# Altium schematic sheet RoughGNSS.SchDoc
size A4; SheetNumber: 12; SheetTotal: 14
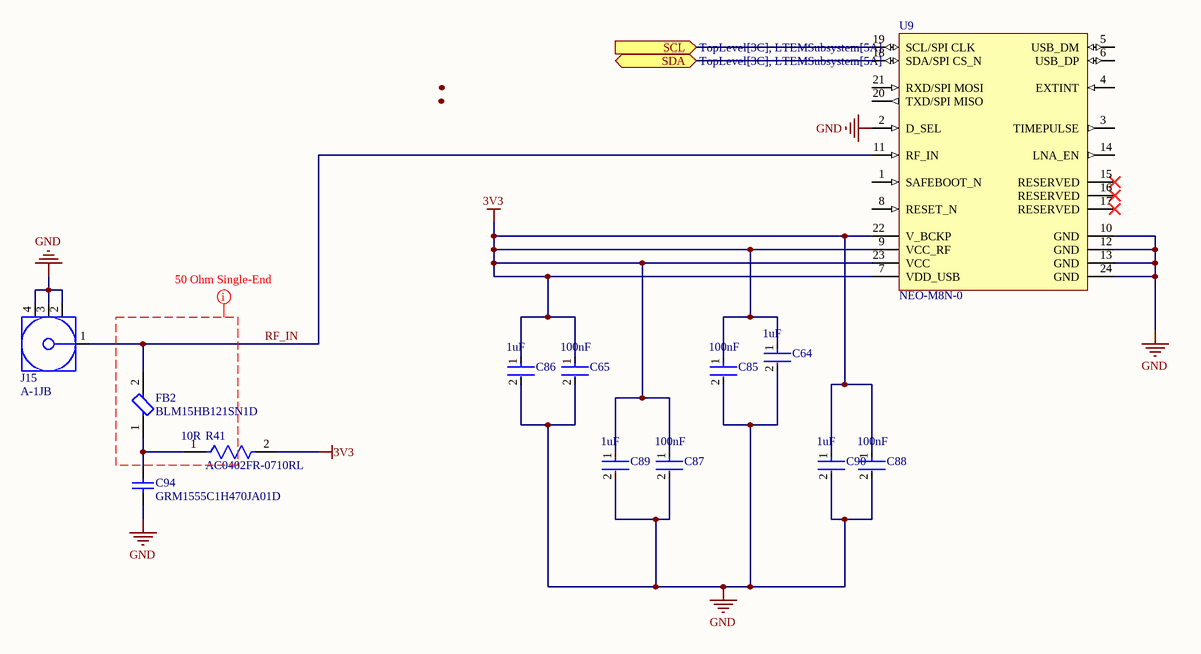
[diagram p0: RoughGNSS.SchDoc]

## Parts
C64  Capacitance: 1uF  [FP-CL511-IPC_C]  (hidden comment: CL05A105KP5NNNC)
C65  Capacitance: 100nF  [FP-GRM155-0_05-IPC_C]  (hidden comment: GRM155R71E104KE14J)
C85  Capacitance: 100nF  [FP-GRM155-0_05-IPC_C]  (hidden comment: GRM155R71E104KE14J)
C86  Capacitance: 1uF  [FP-CL511-IPC_C]  (hidden comment: CL05A105KP5NNNC)
C87  Capacitance: 100nF  [FP-GRM155-0_05-IPC_C]  (hidden comment: GRM155R71E104KE14J)
C88  Capacitance: 100nF  [FP-GRM155-0_05-IPC_C]  (hidden comment: GRM155R71E104KE14J)
C89  Capacitance: 1uF  [FP-CL511-IPC_C]  (hidden comment: CL05A105KP5NNNC)
C90  Capacitance: 1uF  [FP-CL511-IPC_C]  (hidden comment: CL05A105KP5NNNC)
C94  GRM1555C1H470JA01D  [CAPC1005X55X25LL05T10]
FB2  BLM15HB121SN1D  [FP-BLM15-0_05-IPC_B]
J15  A-1JB  [AMPH-A-1JB_V]
R41  AC0402FR-0710RL  Resistance: 10R  [FP-AC0402-IPC_B]
U9  NEO-M8N-0  [UBX-NEO-M8-24_V]

## Ports
SCL (in, see TopLevel[3C], LTEMSubsystem[5A]), SDA (bidir, see TopLevel[3C], LTEMSubsystem[5A])

## Nets
3V3: C64.1 C65.1 C85.1 C86.1 C87.1 C88.1 C89.1 C90.1 R41.2 U9.7(VDD_USB) U9.9(VCC_RF) U9.22(V_BCKP) U9.23(VCC)
GND: C64.2 C65.2 C85.2 C86.2 C87.2 C88.2 C89.2 C90.2 C94.1 J15.2 J15.3 J15.4 U9.2(D_SEL) U9.10(GND) U9.12(GND) U9.13(GND) U9.24(GND)
RF_IN: FB2.2 J15.1 U9.11(RF_IN)
SCL: U9.19(SCL/SPI_CLK) ; port SCL
SDA: U9.18(SDA/SPI_CS_N) ; port SDA
NetC94_2: C94.2 FB2.1 R41.1

Not connected (* = marked no-connect by the designer): U9 1(SAFEBOOT_N) 3(TIMEPULSE) 4(EXTINT) 5(USB_DM) 6(USB_DP) 8(RESET_N) 14(LNA_EN) 15(RESERVED)* 16(RESERVED)* 17(RESERVED)* 20(TXD/SPI_MISO) 21(RXD/SPI_MOSI)

## Layout directives
net class 50SE: (no net found under the mark)

## Library data of the parts
C64 C86 C89 C90 = CMP-13271-001936-1: Cap Ceramic 1uF 10V X5R ±10% SMD 0402 +85°C Paper T/R; Depth: 0.5mm; Case Code (Imperial): 0402; Material: Ceramic; Mount: Surface Mount; Thickness: 0.022inch; Dielectric: X5R; Radiation Hardening: No; Case/Package: 0402; Length: 1mm; Tolerance: 10%; Max Operating Temperature: 85°C; Package Quantity: 1; Width: 0.02inch; Voltage Rating: 10V; Contact Plating: Tin; Height: 0.5mm; Min Operating Temperature: -55°C; Case Code (Metric): 1005; Packaging: Tape and Reel
C65 C85 C87 C88 = CMP-06035-003995-1: Chip Multilayer Ceramic Capacitors for General Purpose, 0402, 0.10uF, X7R, 15%, 10%, 25V; Resistor Type: Ceramic; Tolerance: 10%; Case Code (Metric): 1005; Termination: SMD/SMT; Mount: Surface Mount; Voltage Rating: 25V; Voltage Rating (DC): 25V; Case Code (Imperial): 0402; Max Operating Temperature: 125°C; Weight: 0.000212oz; Case/Package: 0402; Length: 0.039inch; Width: 0.5mm; Thickness: 0.022inch; Height: 0.5mm; Packaging: Tape and Reel; Package Quantity: 50000; Min Operating Temperature: -55°C; Dielectric: X7R
C94 = CMP-2008-04368-1: Manufacturer: Murata; Part Number: GRM1555C1H470JA01D
FB2 = CMP-0686-00154-4: Chip Ferrite Bead, 0402, 120Ω @ 100MHz, 0.7Ω, 25%, 300mA; Impedance: 120R; DC Resistance (DCR): 700mR; Number of Lines: 1; Material: Steel; Lead Free: Lead Free; Min Operating Temperature: -55°C; Package Quantity: 10000; Tolerance: 25%; REACH SVHC: No SVHC; Termination: SMD/SMT; Number of Pins: 2; Frequency: 100MHz; Weight: 2.3E-05oz; Test Frequency: 100MHz; Series: BLM15H; Max DC Current: 300mA; Packaging: Tape and Reel; Width: 0.5mm; Max Current Rating: 300mA; Height: 0.5mm; Depth: 0.55mm; Case Code (Imperial): 0402; RoHS Compliant: Yes; Max Operating Temperature: 125°C; Current Rating: 300mA; Case Code (Metric): 1005; Number of Circuits: 1; Length: 1mm; Case/Package: 0402
J15 = CMP-1743-00001-1: AMC PCB Jack, 0 to 60 GHz, 60 V, -40 to 90 degC, 4-Pin SMD, RoHS, Tape and Reel; Capacitance: 100 uF; Case\Package: 2917; Voltage Rating (DC): 10 V; ESR: 700 mohm; Tolerance: 10%; ComponentLink1Description: Datasheet; PackageDescription: 4-Pin Surface Mount Device, Body 2.6 x 2.6 mm; Radiation Hardening: No; Package Quantity: 1; REACH SVHC: No SVHC; DatasheetVersion: Rev. K, 05/2016; ComponentLink1URL: http://drawings.amphenolrf.com/Customer_Outline/CA-1JB.pdf; Pins: 2; Packaging: Tape and Reel; Min Operating Temperature: -55 degC; RoHSCompliant: true; Length: 7.3 mm; PackageReference: A-1JB; Weight: 0.023634 oz; Mount: Surface Mount; Voltage Rating: 10 V; Max Operating Temperature: 125 degC; Height: 3.1 mm; Case Code (Imperial): 2917; Case Code (Metric): 7343; Width: 4.3 mm
R41 = CMP-2002-01791-3: RES 10Ω ±1% 0.063W 0402; Temperature Coefficient: 200ppm/°C; Power Rating: 62.5mW; Voltage Rating: 50V; Max Power Dissipation: 63mW; Min Operating Temperature: -55°C; Packaging: Tape and Reel; Number of Terminations: 2; Max Operating Temperature: 155°C; Size Code: 0402; Ratings: AEC-Q200; Tolerance: 1%; Resistor Type: Thick Film; Length: 1mm; Width: 0.5mm; Height: 0.32mm; Termination: SMD/SMT; Case/Package: 0402; Case Code (Metric): 1005; Lead Free: Lead Free; Features: Moisture Resistant; Series: AC; Case Code (Imperial): 0402
U9 = CMP-2000-07559-1: U-Blox M8 Concurrent Gnss Module, 3.6 V, -40 to 85 degC, 24-Pin SMD, RoHS, Tape and Reel; Mounting Technology: SurfaceMount; Manufacturer: U-Blox; Manufacturer URL: https://www.u-blox.com/en; Package Reference: NEO-M8N-0; Datasheet Version: Rev. R03, 08/2016; RoHSCompliant: False; Package URL: https://www.u-blox.com/sites/default/files/NEO-8Q-NEO-M8-FW3_HardwareIntegrationManual_%28UBX-15029985%29.pdf; Datasheet URL: https://www.u-blox.com/sites/default/files/NEO-M8-FW3_DataSheet_%28UBX-15031086%29.pdf; Package Description: 24-Pin Surface Mount Device, Body 16 x 12.2 mm, Pitch 1.1 mm